# Altium project Bass Guitar Amp.PrjPcb (part 1 of 4)
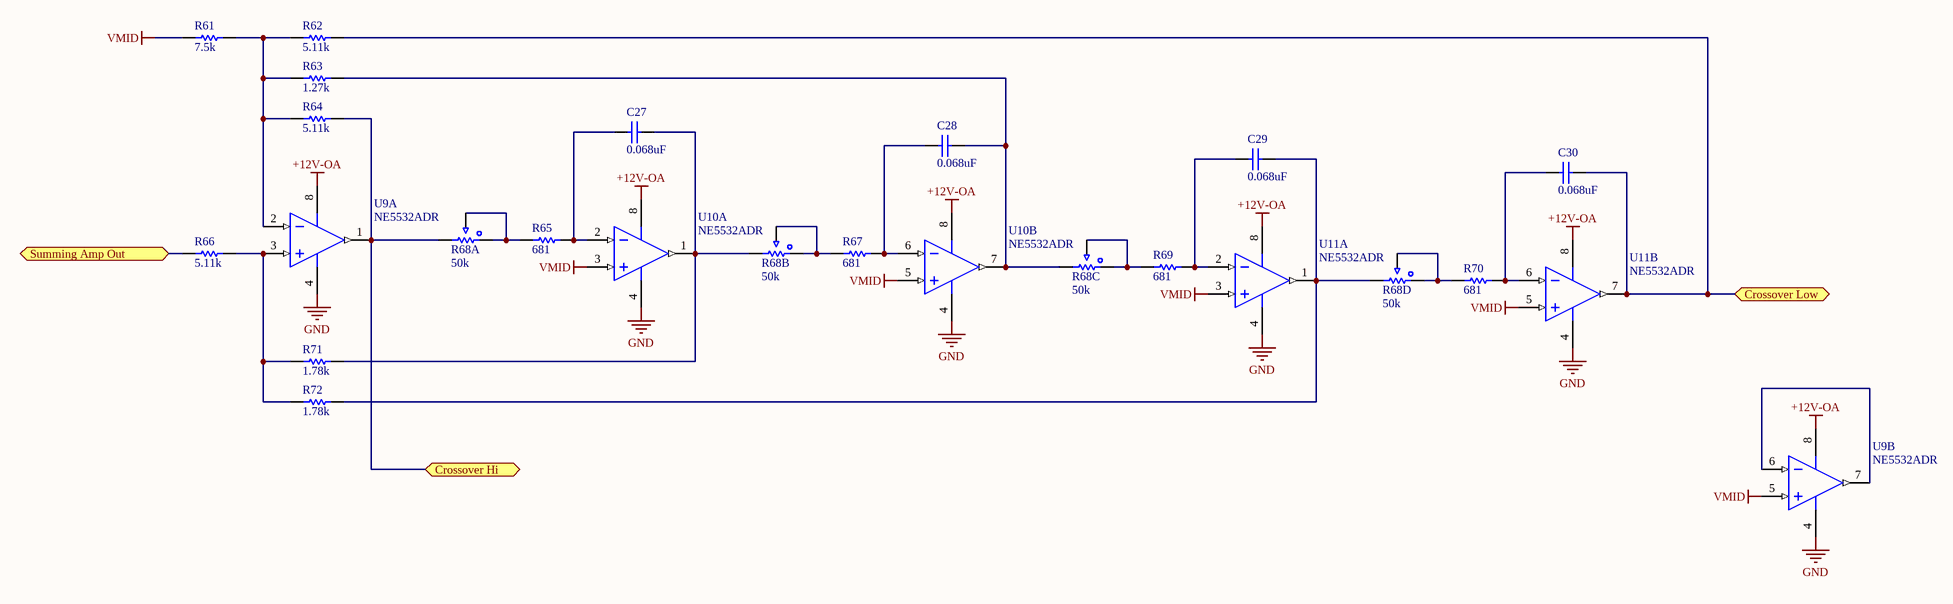
[diagram p0: Crossover.SchDoc]
5 sheets, 270 parts. Net scope: flat (ports and power ports of the same name join across sheets).
Sheets:
  Crossover.SchDoc
  IO Management.SchDoc
  Power Management.SchDoc
  Power Stage.SchDoc
  SideGig.SchDoc

## Sheet Crossover.SchDoc
size C

### Parts
C27  0.068uF  [RESC3216X70X50NL05T20]
C28  0.068uF  [RESC3216X70X50NL05T20]
C29  0.068uF  [RESC3216X70X50NL05T20]
C30  0.068uF  [RESC3216X70X50NL05T20]
R61  7.5k  [RESC1609X55X28LL05T18]
R62  5.11k  [PCB-dm6f2vlmfnf97yy2nsh5-1]
R63  1.27k  [RESC1609X55X28LL05T18]
R64  5.11k  [PCB-dm6f2vlmfnf97yy2nsh5-1]
R65  681  [RESC1609X55X28LL05T18]
R66  5.11k  [PCB-dm6f2vlmfnf97yy2nsh5-1]
R67  681  [RESC1609X55X28LL05T18]
R68  50k  [PCB-3c7eria7znpasna51pjn-1]  (parts A,B,C,D of 4)
R69  681  [RESC1609X55X28LL05T18]
R70  681  [RESC1609X55X28LL05T18]
R71  1.78k  [RESC1609X55X28LL05T18]
R72  1.78k  [RESC1609X55X28LL05T18]
U9  NE5532ADR  [TI-D8_L]  (parts A,B of 2)
U10  NE5532ADR  [TI-D8_L]  (parts A,B of 2)
U11  NE5532ADR  [TI-D8_L]  (parts A,B of 2)

### Ports
Crossover Hi, Crossover Low, Summing Amp Out

### Nets
+12V-OA: U9.8(VCC+) U10.8(VCC+) U11.8(VCC+)
GND: U9.4(VCC-) U10.4(VCC-) U11.4(VCC-)
VMID: R61.1 U9.5(IN2+) U10.3(IN1+) U10.5(IN2+) U11.3(IN1+) U11.5(IN2+)
NetC27_1: C27.1 R65.2 U10.2(IN1-)
NetC27_2: C27.2 R68.R2_3 R71.2 U10.1(OUT1)
NetC28_1: C28.1 R67.2 U10.6(IN2-)
NetC28_2: C28.2 R63.2 R68.R3_3 U10.7(OUT2)
NetC29_1: C29.1 R69.2 U11.2(IN1-)
NetC29_2: C29.2 R68.R4_3 R72.2 U11.1(OUT1)
NetC30_1: C30.1 R70.2 U11.6(IN2-)
NetC30_2: C30.2 R62.2 U11.7(OUT2) ; port Crossover Low
NetJ3_3: R64.2 R68.R1_3 U9.1(OUT1) ; port Crossover Hi
NetJ3_4: R66.1 ; port Summing Amp Out
NetR61_2: R61.2 R62.1 R63.1 R64.1 U9.2(IN1-)
NetR65_1: R65.1 R68.R1_1 R68.R1_2
NetR66_2: R66.2 R71.1 R72.1 U9.3(IN1+)
NetR67_1: R67.1 R68.R2_1 R68.R2_2
NetR68_R3_1: R68.R3_1 R68.R3_2 R69.1
NetR68_R4_1: R68.R4_1 R68.R4_2 R70.1
NetU9_6: U9.6(IN2-) U9.7(OUT2)

### Library data of the parts
C27-C30 = CMP-f94231c42cf32685-1: C Series 1206 50 V 0.068 uF ±5% Tolerance C0G SMT Multilayer Ceramic Capacitor; Voltage Rating (DC): 50.0 V; RoHS: Compliant
R61 = CMP-2e48e5fbd8dbf18f-1: Res Thin Film 0603 7.5K Ohm 0.1% 0.1W(1/10W) ±25ppm/C SMD Automotive T/R; Manufacturer: Vishay; Manufacturer Part Number: MCT0603MD7501BP100; Octopart URL: http://octopart.com/mct0603md7501bp100-vishay-45732853; Case/Package: 0603; Packaging: Reel; RoHS: Compliant; OctopartID: 2e48e5fbd8dbf18f
R62 R64 R66 = CMP-3220f9ecb51bede7-1: Res Thin Film 0603 5.11K Ohm 0.1% 1/10W ±25ppm/°C Molded SMD SMD Paper T/R; Manufacturer Part Number: MCT06030D5111BP100; Power Rating: 100 mW; Octopart URL: http://octopart.com/mct06030d5111bp100-vishay-46572125; Packaging: Tape & Reel (TR); RoHS: Compliant
R63 = CMP-169edd529233c959-1: Res Thin Film 0603 1.27K Ohm 0.1% 1/10W ±25ppm/°C Molded SMD SMD Paper T/R; Manufacturer Part Number: MCT06030D1271BP100; Voltage Rating (DC): 50.0 V; Resistance: 1.27 kΩ; Temperature Coefficient: 25.0 ppm/°C; Power Rating: 100 mW; Lead-Free Status: Lead Free; Size-Height: 450 µm; Case/Package: 0603; Octopart URL: http://octopart.com/mct06030d1271bp100-vishay-46571979; Mounting Style: Surface Mount; RoHS: Compliant; OctopartID: 169edd529233c959; Size-Width: 850 µm; Resistance Tolerance: ±0.1%
R65 R67 R69 R70 = CMP-437288bec46a9cb5-1: Res Thin Film 0603 681 Ohm 0.1% 1/10W ±25ppm/°C Molded SMD SMD Paper T/R; OctopartID: 437288bec46a9cb5; Size-Height: 450 µm; Mounting Style: Surface Mount
R68 = CMP-1b48d3c31cb2c48f-2: PTD90 Series 9mm Multi Ganged Potentiometer 50K Ohm 20% 0.05 W 1(Elec)/1(Mech)Turn Panel Mount/Thru-Hole Tray; Octopart URL: http://octopart.com/ptd904-2015k-b503-bourns-25240220; OctopartID: 1b48d3c31cb2c48f; Resistance: 50k
R71 R72 = CMP-0169caa585e3deae-1: Res Thin Film 0603 1.78K Ohm 0.1% 1/10W ±25ppm/°C Molded SMD Paper T/R; Power Rating: 100 mW
U9-U11 = CMP-13597030-2: Dual Low-Noise Operational Amplifier, 10 to 30 V, 0 to 70 degC, 8-pin SOIC (D8), Green (RoHS & no Sb/Br); Bandwidth: 10000000.0 Hz; Lead-Free Status: Lead Free; Number of Channels: 2; Slew Rate: 9.0 V/μs; Supply Voltage (DC): 30.0 V; Gain Bandwidth Product: 10000000.0 Hz; Lifecycle Status: Active; Mounting Style: Surface Mount; Number of Circuits: 2; Number of Pins: 8; Octopart Url: https://octopart.com/ne5532adr-texas+instruments-409175; OctopartID: 270fee033c3ef8c8; Packaging: Tape & Reel (TR); REACH SVHC Compliance: No SVHC; RoHS: Compliant

## Sheet IO Management.SchDoc
size C
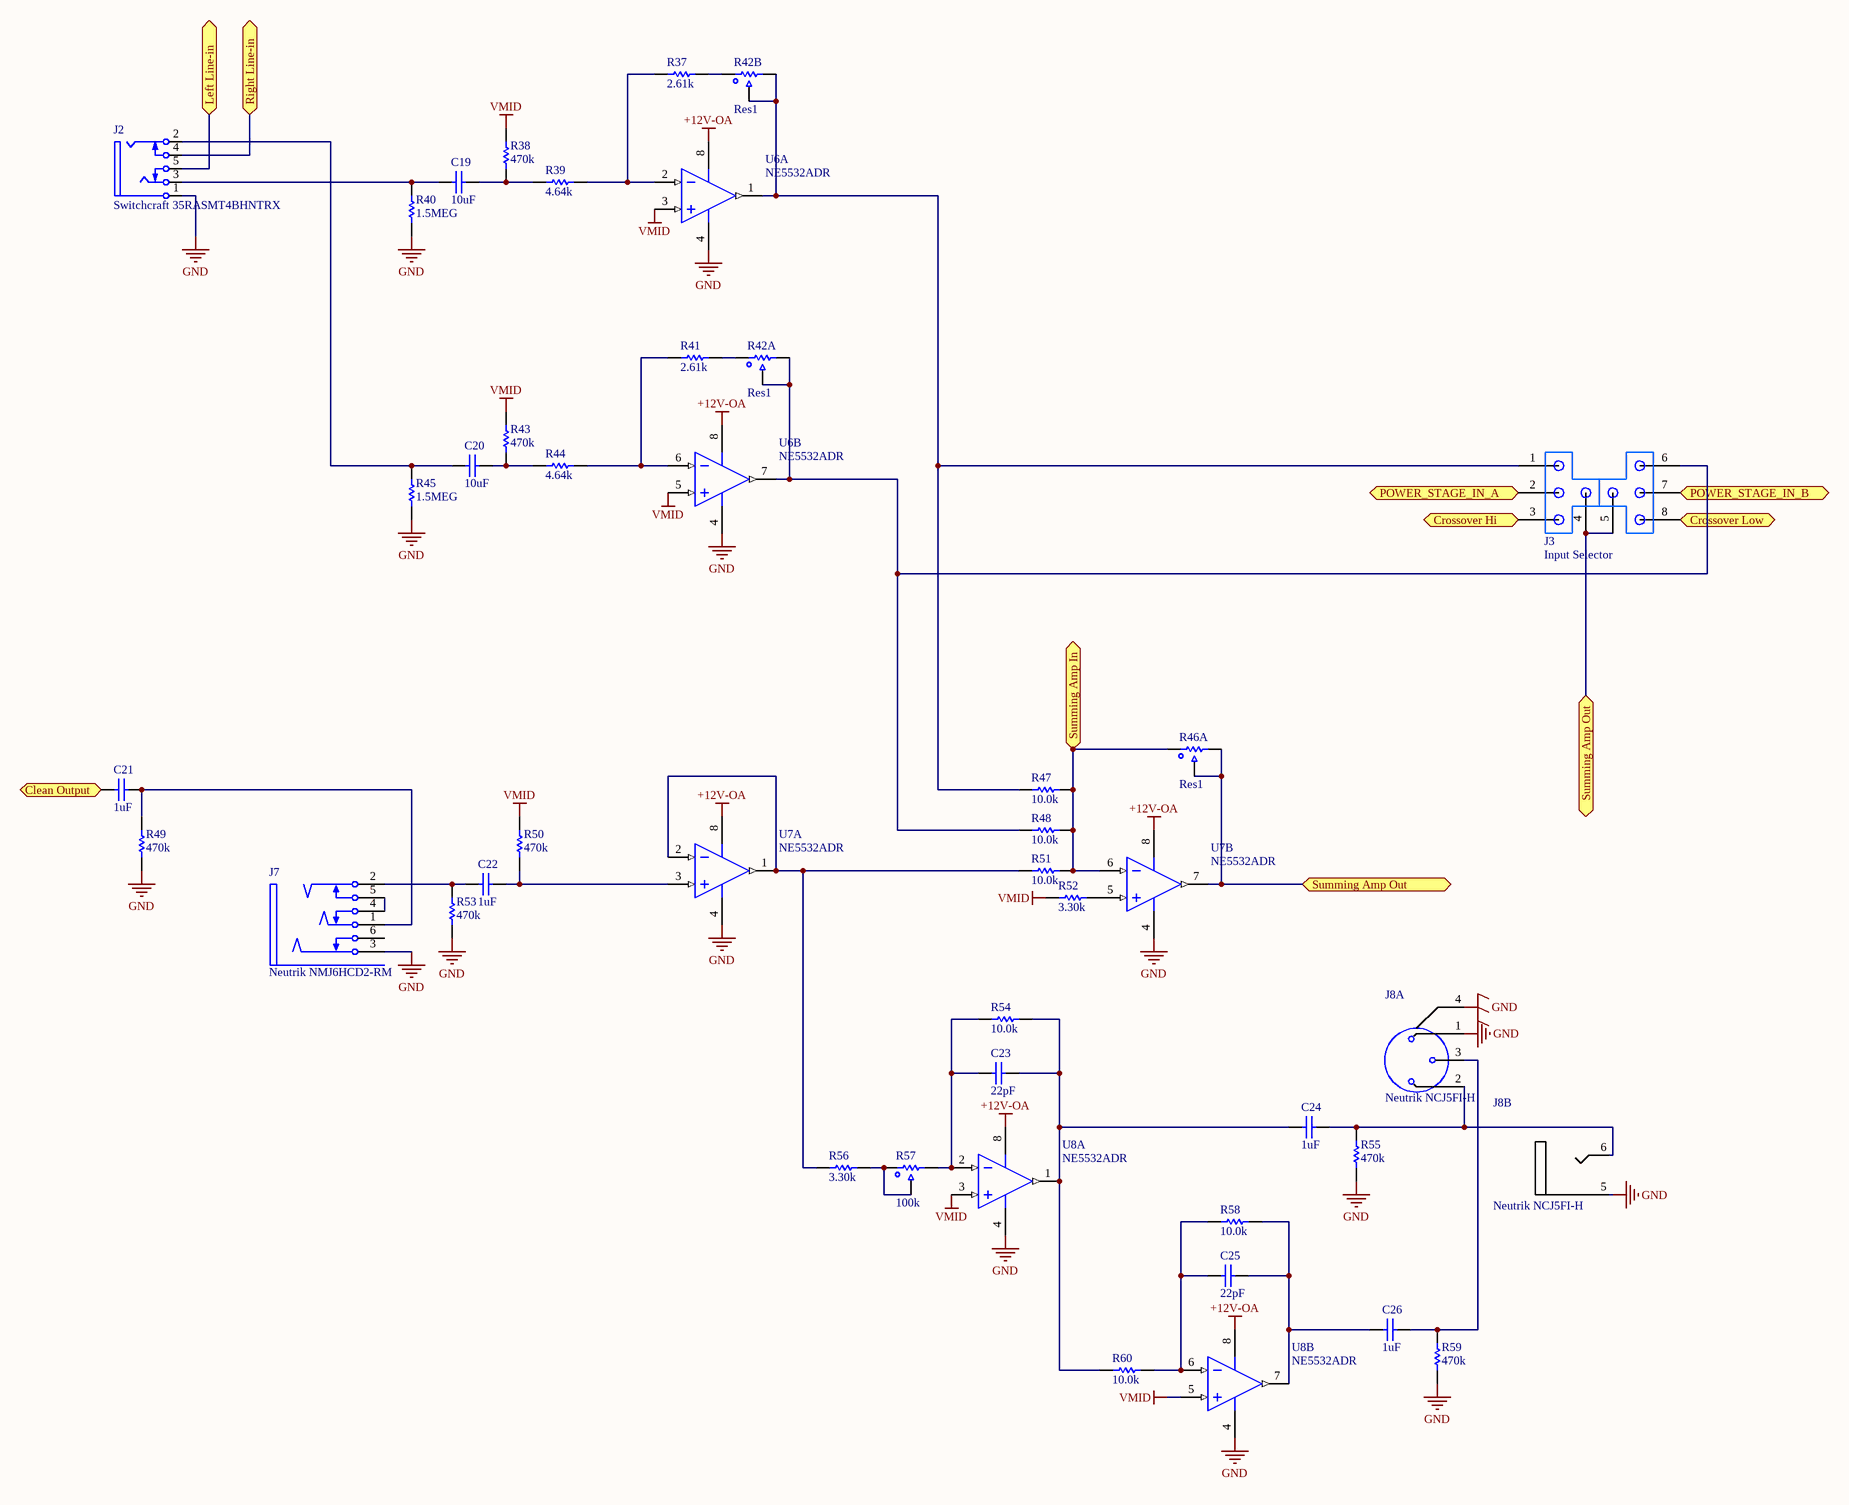
[diagram p1: IO Management.SchDoc]

### Parts
C19  10uF  [PCB-5c5sxu4lzqbcrp2k6kwf-1]
C20  10uF  [PCB-5c5sxu4lzqbcrp2k6kwf-1]
C21  1uF  [PCB-2wbb7ys4jm9z9dflo2i2-1]
C22  1uF  [PCB-2wbb7ys4jm9z9dflo2i2-1]
C23  22pF  [PCB-o7p1koxmr9wqz41gh50t-1]
C24  1uF  [PCB-2wbb7ys4jm9z9dflo2i2-1]
C25  22pF  [PCB-o7p1koxmr9wqz41gh50t-1]
C26  1uF  [PCB-2wbb7ys4jm9z9dflo2i2-1]
J2  Switchcraft 35RASMT4BHNTRX  [SWIT-35RASMT4BHNTRX_V]
J3  Input Selector  [PCB-r6lzv2511lj5epnn9hpr-1]
J7  Neutrik NMJ6HCD2-RM  [PCB-3345220-1]
J8  Neutrik NCJ5FI-H  [PCB-kqs2tegzu26oi3jl7i0a-1]  (parts A,B of 2)
R37  2.61k  [PCB-2fy4x9bysi6rpexrr8fu-1]
R38  470k  [RESC1609X55X28LL05T18]
R39  4.64k  [RESC1609X55X28LL05T18]
R40  1.5MEG  [RESC1608X55X30LL15T15]
R41  2.61k  [PCB-2fy4x9bysi6rpexrr8fu-1]
R42  Res1  [PCB-3c7eria7znpasna51pjn-1]  (parts A,B of 2)
R43  470k  [RESC1609X55X28LL05T18]
R44  4.64k  [RESC1609X55X28LL05T18]
R45  1.5MEG  [RESC1608X55X30LL15T15]
R46  Res1  [PCB-3c7eria7znpasna51pjn-1]  (part A of 2)
R47  10.0k  [RESC1609X55X28LL05T18]
R48  10.0k  [RESC1609X55X28LL05T18]
R49  470k  [RESC1609X55X28LL05T18]
R50  470k  [RESC1609X55X28LL05T18]
R51  10.0k  [RESC1609X55X28LL05T18]
R52  3.30k  [RESC1609X55X28LL05T18]
R53  470k  [RESC1609X55X28LL05T18]
R54  10.0k  [RESC1609X55X28LL05T18]
R55  470k  [RESC1609X55X28LL05T18]
R56  3.30k  [RESC1609X55X28LL05T18]
R57  100k  [PCB-3c7eria7znpasna51pjn-1]
R58  10.0k  [RESC1609X55X28LL05T18]
R59  470k  [RESC1609X55X28LL05T18]
R60  10.0k  [RESC1609X55X28LL05T18]
U6  NE5532ADR  [TI-D8_L]  (parts A,B of 2)
U7  NE5532ADR  [TI-D8_L]  (parts A,B of 2)
U8  NE5532ADR  [TI-D8_L]  (parts A,B of 2)

### Ports
Clean Output, Crossover Hi, Crossover Low, Left Line-in, POWER_STAGE_IN_A, POWER_STAGE_IN_B, Right Line-in, Summing Amp In, Summing Amp Out

### Nets
+12V-OA: U6.8(VCC+) U7.8(VCC+) U8.8(VCC+)
GND: J2.1 J7.3 J8.1 J8.4(G) J8.5(S) R40.1 R45.1 R49.1 R53.1 R55.1 R59.1 U6.4(VCC-) U7.4(VCC-) U8.4(VCC-)
VMID: R38.2 R43.2 R50.2 R52.1 U6.3(IN1+) U6.5(IN2+) U8.3(IN1+) U8.5(IN2+)
NetC19_1: C19.1 J2.3 R40.2
NetC19_2: C19.2 R38.1 R39.1
NetC20_1: C20.1 J2.2 R45.2
NetC20_2: C20.2 R43.1 R44.1
NetC21_1: C21.1 ; port Clean Output
NetC21_2: C21.2 J7.1 R49.2
NetC22_1: C22.1 J7.2 R53.2
NetC22_2: C22.2 R50.1 U7.3(IN1+)
NetC23_1: C23.1 R54.1 R57.3 U8.2(IN1-)
NetC23_2: C23.2 C24.1 R54.2 R60.1 U8.1(OUT1)
NetC24_2: C24.2 J8.2 J8.6(T) R55.2
NetC25_1: C25.1 R58.1 R60.2 U8.6(IN2-)
NetC25_2: C25.2 C26.1 R58.2 U8.7(OUT2)
NetC26_2: C26.2 J8.3 R59.2
NetC30_2: J3.8 ; port Crossover Low
NetJ2_4: J2.4 ; port Right Line-in
NetJ2_5: J2.5 ; port Left Line-in
NetJ3_1: J3.1 R42.R2_2 R42.R2_3 R47.1 U6.1(OUT1)
NetJ3_2: J3.2 ; port POWER_STAGE_IN_A
NetJ3_3: J3.3 ; port Crossover Hi
NetJ3_4: J3.4 J3.5 R46.R1_2 R46.R1_3 U7.7(OUT2) ; port Summing Amp Out
NetJ3_6: J3.6 R42.R1_2 R42.R1_3 R48.1 U6.7(OUT2)
NetJ3_7: J3.7 ; port POWER_STAGE_IN_B
NetJ7_4: J7.4 J7.5
NetJ15_4: R46.R1_1 R47.2 R48.2 R51.2 U7.6(IN2-) ; port Summing Amp In
NetR37_1: R37.1 R39.2 U6.2(IN1-)
NetR37_2: R37.2 R42.R2_1
NetR41_1: R41.1 R44.2 U6.6(IN2-)
NetR41_2: R41.2 R42.R1_1
NetR51_1: R51.1 R56.1 U7.1(OUT1) U7.2(IN1-)
NetR52_2: R52.2 U7.5(IN2+)
NetR56_2: R56.2 R57.1 R57.2

Not connected (* = marked no-connect by the designer): J7 6

### Library data of the parts
C19 C20 = CMP-f13b3967d5202efc-1: Cap Film 10uF 63V PET 5% (26.5 X 8.5 X 17mm) Radial Wound 22.5mm 105C Automotive Bulk; Manufacturer Part Number: 60DN51005030J; Manufacturer: Kemet; RoHS: Compliant; Capacitance: 10uF; OctopartID: f13b3967d5202efc
C21 C22 C24 C26 = CMP-85fe4cf7e9a75a39-2: B32529 Series 63 V 1 uF Radial LS=5 mm Stacked Metallized PET Film Capacitor; Manufacturer Part Number: B32529C105J289; Manufacturer: TDK; Capacitance: 1uF
C23 C25 = CMP-5839914dedd787fe-1: CL10 Series 22 pF 50V ±5 % Tolerance C0G SMT Multilayer Ceramic Capacitor; Manufacturer: Samsung; Manufacturer Part Number: CL10C220JB8NNNC; Dielectric Characteristic: C0G/NP0; Octopart URL: http://octopart.com/cl10c220jb8nnnc-samsung-8294536; Mounting Style: Surface Mount
J2 = CMP-329442-8: Female 3.5 mm Phone Jack, 5 Position, Height 5 mm, RoHS, Tape and Reel; Lead-Free Status: Lead Free; RoHS: Compliant; PackageDescription: Female 3.5 mm Phone Jack, 5 Position, Height 5 mm; OctopartID: 05ecccef17f4da2b; Seller Landing  Url: https://octopart-clicks.com/click/track?country=US&ak=8157f166&sig=00fbda3&sid=459&ppid=604030&vpid=40873333&ct=offers; Octopart Url: http://octopart.com/35rasmt4bhntrx-switchcraft-604030; PackageReference: 35RASMT4BHNTRX; Manufacturer Part Number: 35RASMT4BHNTRX; DatasheetVersion: Rev. C, 07/2014
J3 = CMP-fydh8mqcn19uwpn0klog-2: 3 way stereo H-shaped pin header jumper 2.54mm
J7 = CMP-3345220-6: Phone Connectors 1/4" STERO JCK SWTCH FULL TRD NSE PC HORZ; OctopartID: de6b171403b801ac; Manufacturer: Neutrik; Manufacturer Part Number: NMJ6HCD2-RM; Octopart Url: https://octopart.com/nmj6hcd2-rm-neutrik-7731381
J8 = CMP-d6ad1fac6a3f096a-1: Neutrik NCJ5FI-H Combo 3-Pin XLRF / 1/4 Inch Mono Horizontal PCB Mount; Gender: Female; Voltage Rating (DC): 50.0 V; Number of Positions: 5; Octopart URL: http://octopart.com/ncj5fi-h-neutrik-760308; OctopartID: d6ad1fac6a3f096a; Contact Plating: Gold; Mounting Style: Solder, PCB; RoHS: Compliant; Manufacturer Part Number: NCJ5FI-H; Manufacturer: Neutrik
R37 R41 = CMP-9c6957e4a20743ae-1: Res Thin Film 0603 2.61K Ohm 0.1% 1/10W ±25ppm/°C Molded SMD Paper T/R; Manufacturer: Vishay; Manufacturer Part Number: MCT06030D2611BP100; Resistance: 2.61 kΩ; Power Rating: 100 mW; Size-Length: 1.55 mm; Resistance Tolerance: ±0.1%; Packaging: Tape & Reel (TR)
R38 R43 R49 R50 R53 R55 R59 = CMP-f7e03fd772d42827-1: Res Thin Film 0603 470K Ohm 0.1% 1/10W ±25ppm/°C Molded SMD SMD Paper T/R; Manufacturer Part Number: MCT06030D4703BP100; Lead-Free Status: Lead Free
R39 R44 = CMP-ae07668bb89171c0-1: Res Thin Film 0603 4.64K Ohm 0.1% 1/10W ±25ppm/°C Molded SMD SMD Paper T/R; Manufacturer Part Number: MCT06030D4641BP100; Power Rating: 100 mW; Lead-Free Status: Lead Free; Size-Width: 850 µm; Size-Length: 1.55 mm; Packaging: Tape & Reel (TR); Case/Package: 0603; Mounting Style: Surface Mount; Octopart URL: http://octopart.com/mct06030d4641bp100-vishay+semiconductor-25572336; Resistance Tolerance: ±0.1%; OctopartID: ae07668bb89171c0; RoHS: Compliant
R40 R45 = CMP-3681775-2: Thick Film Resistors - SMD 0603 1.5Mohms 1% Tol; Manufacturer Part Number: ERJ-3EKF1504V; Manufacturer: Panasonic; Lead-Free Status: Lead Free; Power Rating: 0.1 W; Resistance: 1500000.0 Ω; Voltage Rating (DC): 75.0 V; Case/Package: 0603; Lifecycle Status: Not Listed by Manufacturer; Mounting Style: Surface Mount; Octopart Url: https://octopart.com/erj-3ekf1504v-panasonic-55421490; OctopartID: f919335e764d26de; Packaging: Cut Tape (CT); Resistance Tolerance: ±1%; RoHS: Compliant; Size-Height: 0.00045 m; Size-Length: 0.0016 m; Size-Width: 0.0008 m
R42 R46 = CMP-f1923a8ba4e42e55-1: Panel Control - 9mm-St-Carbon; Packaging: Tray
R47 R48 R51 R54 R58 R60 = CMP-893e42b9f3a056f9-1: Precision Thin Film Smnt Resistor 0603 Case 10kOhm +/-0.1% 0.1W +/-25ppm/degC; Manufacturer: Vishay; Manufacturer Part Number: MCT06030D1002BP100; Lead-Free Status: Lead Free; Resistance Tolerance: ±0.1%; Voltage Rating (DC): 50.0 V; Resistance: 10.0 kΩ; Power Rating: 100 mW; Packaging: Tape & Reel (TR); RoHS: Compliant; Mounting Style: Surface Mount; Size-Length: 1.55 mm; Size-Width: 850 µm; Octopart URL: http://octopart.com/mct06030d1002bp100-vishay-42819576; Case/Package: 0603; Size-Height: 450 µm
R52 R56 = CMP-182ad3b0fdf8c7ed-1: Precision Thin Film Smnt Resistor 0603 Case 3.3kOhm +/-0.1% 0.1W +/-25ppm/C; Manufacturer: Vishay; Manufacturer Part Number: MCT06030D3301BP100; Resistance: 3.30 kΩ; Resistance Tolerance: ±0.1%; Octopart URL: http://octopart.com/mct06030d3301bp100-vishay-43040948; RoHS: Compliant; Size-Height: 450 µm; OctopartID: 182ad3b0fdf8c7ed; Case/Package: 0603; Mounting Style: Surface Mount; Size-Width: 850 µm
R57 = CMP-015dc8c8d918de9a-1: Pot 100k Ohm 1/20w Carbon Linear; Manufacturer Part Number: PTD901-2015F-B104; Mounting Style: PCB, Board, Panel; OctopartID: 015dc8c8d918de9a; Packaging: Tray
U6-U8 = CMP-13597030-2: as U9 on sheet Crossover; Gain Bandwidth Product: 10000000.0 Hz; Lifecycle Status: Active; Mounting Style: Surface Mount; Number of Circuits: 2; Number of Pins: 8; Octopart Url: https://octopart.com/ne5532adr-texas+instruments-409175; OctopartID: 270fee033c3ef8c8; Packaging: Tape & Reel (TR); REACH SVHC Compliance: No SVHC; RoHS: Compliant

## Sheet Power Management.SchDoc
size C
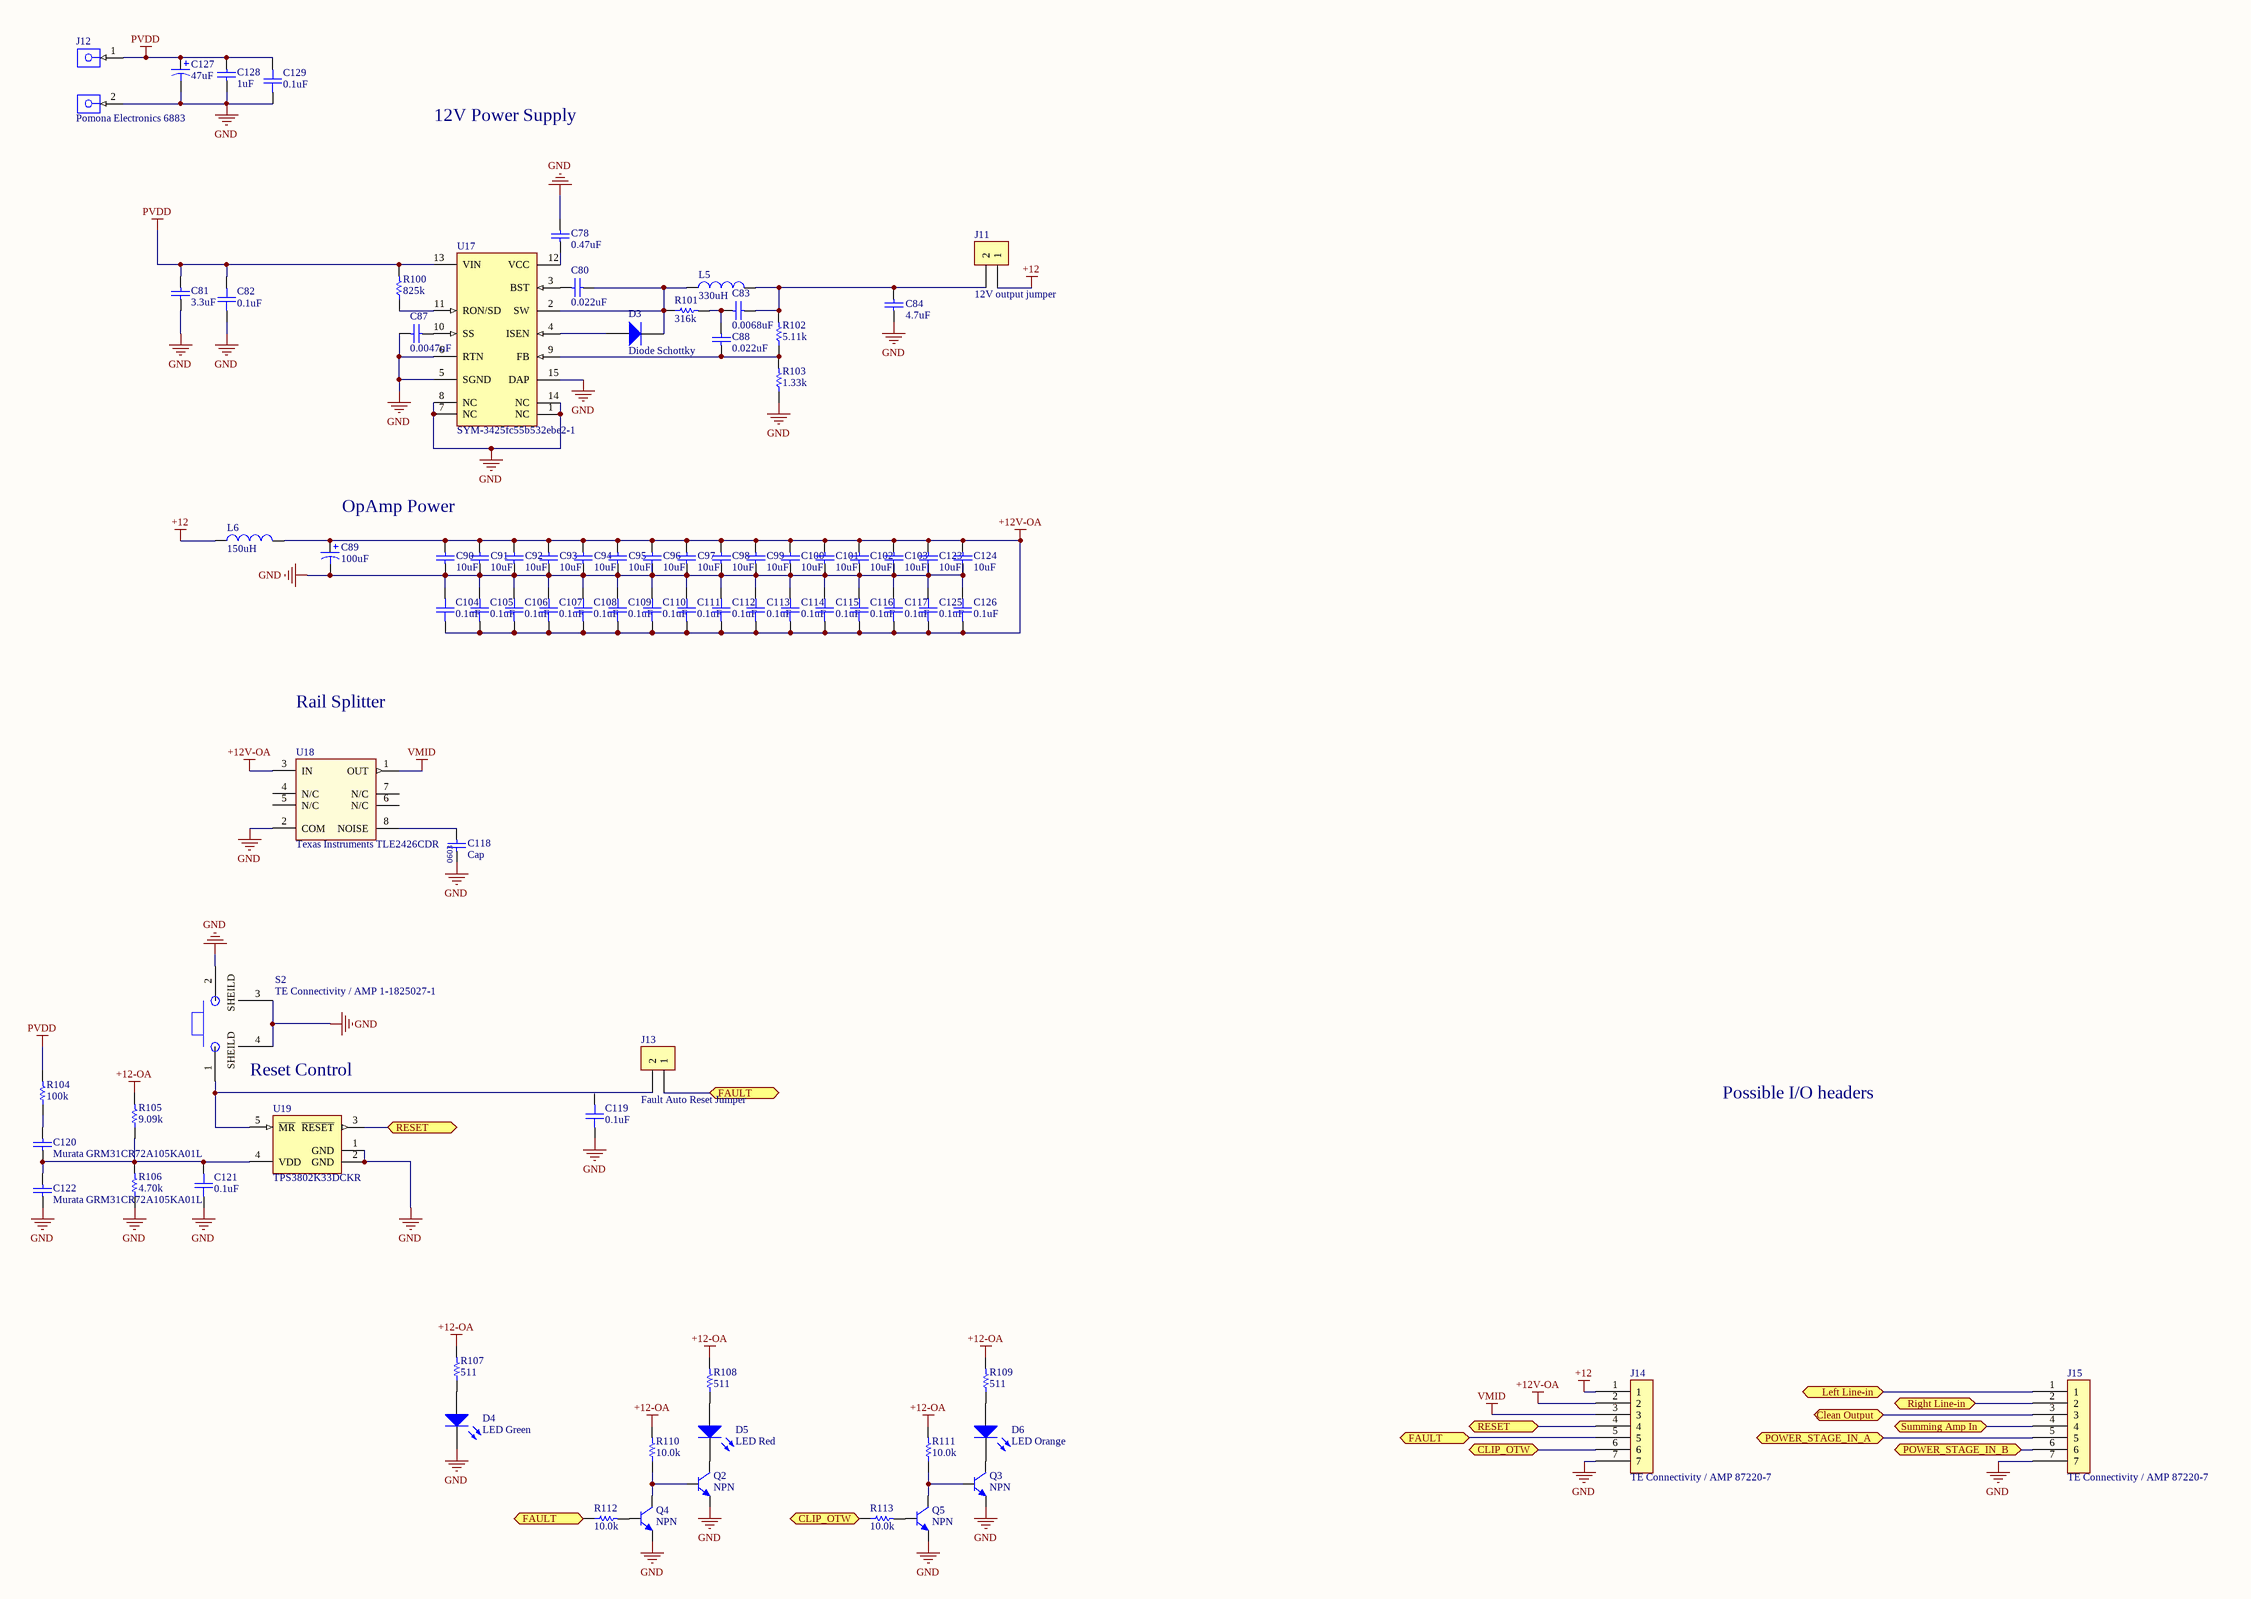
[diagram p2: Power Management.SchDoc]

### Parts
C78  0.47uF  [PCB-i0dme2so6deleduh8uuv-1]
C80  0.022uF  [CAPC1608X87X35NL15T15]
C81  3.3uF  [PCB-chn8p1js4k1ngrwxbp4y-1]
C82  0.1uF  [PCB-jzhgzaa3ohr19x5vw660-1]
C83  0.0068uF  [CAPC1608X06N]
C84  4.7uF  [CAPC2013X94X50LL20T25]
C87  0.0047uF  [CAPC2012X08M]
C88  0.022uF  [CAPC1608X87X35NL15T15]
C89  100uF  [PCB-in8pxjyymzgw21cvj8kw-1]
C90  10uF  [CAPC3216X94X50NL20T25]
C91  10uF  [CAPC3216X94X50NL20T25]
C92  10uF  [CAPC3216X94X50NL20T25]
C93  10uF  [CAPC3216X94X50NL20T25]
C94  10uF  [CAPC3216X94X50NL20T25]
C95  10uF  [CAPC3216X94X50NL20T25]
C96  10uF  [CAPC3216X94X50NL20T25]
C97  10uF  [CAPC3216X94X50NL20T25]
C98  10uF  [CAPC3216X94X50NL20T25]
C99  10uF  [CAPC3216X94X50NL20T25]
C100  10uF  [CAPC3216X94X50NL20T25]
C101  10uF  [CAPC3216X94X50NL20T25]
C102  10uF  [CAPC3216X94X50NL20T25]
C103  10uF  [CAPC3216X94X50NL20T25]
C104  0.1uF  [PCB-jzhgzaa3ohr19x5vw660-1]
C105  0.1uF  [PCB-jzhgzaa3ohr19x5vw660-1]
C106  0.1uF  [PCB-jzhgzaa3ohr19x5vw660-1]
C107  0.1uF  [PCB-jzhgzaa3ohr19x5vw660-1]
C108  0.1uF  [PCB-jzhgzaa3ohr19x5vw660-1]
C109  0.1uF  [PCB-jzhgzaa3ohr19x5vw660-1]
C110  0.1uF  [PCB-jzhgzaa3ohr19x5vw660-1]
C111  0.1uF  [PCB-jzhgzaa3ohr19x5vw660-1]
C112  0.1uF  [PCB-jzhgzaa3ohr19x5vw660-1]
C113  0.1uF  [PCB-jzhgzaa3ohr19x5vw660-1]
C114  0.1uF  [PCB-jzhgzaa3ohr19x5vw660-1]
C115  0.1uF  [PCB-jzhgzaa3ohr19x5vw660-1]
C116  0.1uF  [PCB-jzhgzaa3ohr19x5vw660-1]
C117  0.1uF  [PCB-jzhgzaa3ohr19x5vw660-1]
C118  Cap  [CAPC1608X07N]
C119  0.1uF  [PCB-jzhgzaa3ohr19x5vw660-1]
C120  Murata GRM31CR72A105KA01L  [CAPC3216X180X55NL20T25]
C121  0.1uF  [PCB-jzhgzaa3ohr19x5vw660-1]
C122  Murata GRM31CR72A105KA01L  [CAPC3216X180X55NL20T25]
C123  10uF  [CAPC3216X94X50NL20T25]
C124  10uF  [CAPC3216X94X50NL20T25]
C125  0.1uF  [PCB-jzhgzaa3ohr19x5vw660-1]
C126  0.1uF  [PCB-jzhgzaa3ohr19x5vw660-1]
C127  47uF  [PCBComponent_1]
C128  1uF  [CAPC3216X180X55NL20T25]
C129  0.1uF  [PCB-jzhgzaa3ohr19x5vw660-1]
D3  Diode Schottky  [PCB-iur9xjol2nuz7see6iaw-1]
D4  LED Green  [PCB - LS A67K]
D5  LED Red  [PCB - LS A67K]
D6  LED Orange  [PCB - LS A67K]
J11  12V output jumper  [PCB-atpiihg40e8c2nmcy2an-1]
J12  Pomona Electronics 6883  [PCB-19368571-1]
J13  Fault Auto Reset Jumper  [PCB-atpiihg40e8c2nmcy2an-1]
J14  TE Connectivity / AMP 87220-7  [PCB-2nimx3srux7q5lcqcrab-1]
J15  TE Connectivity / AMP 87220-7  [PCB-2nimx3srux7q5lcqcrab-1]
L5  330uH  [Coilcraft MSS1210]
L6  150uH  [PCB-lfrzme2idivti55vz3sm-1]
Q2  NPN  [PCB-zwf9crilb66v8jey4z70-1]
Q3  NPN  [PCB-zwf9crilb66v8jey4z70-1]
Q4  NPN  [PCB-zwf9crilb66v8jey4z70-1]
Q5  NPN  [PCB-zwf9crilb66v8jey4z70-1]
R100  825k  [RESC1609X55X28LL05T18]
R101  316k  [RESC1609X55X28LL05T18]
R102  5.11k  [PCB-dm6f2vlmfnf97yy2nsh5-1]
R103  1.33k  [RESC1609X55X28LL05T18]
R104  100k  [RESC1609X55X28LL05T18]
R105  9.09k  [RESC1609X55X28LL05T18]
R106  4.70k  [RESC1609X55X28LL05T18]
R107  511  [RESC1609X55X28LL05T18]
R108  511  [RESC1609X55X28LL05T18]
R109  511  [RESC1609X55X28LL05T18]
R110  10.0k  [RESC1609X55X28LL05T18]
R111  10.0k  [RESC1609X55X28LL05T18]
R112  10.0k  [RESC1609X55X28LL05T18]
R113  10.0k  [RESC1609X55X28LL05T18]
S2  TE Connectivity / AMP 1-1825027-1  [PCB-z0tn1x4l8qb5b43a6q2n-1]
U17  SYM-3425fc55b532ebe2-1  [PCB-d66e4jgxn3exdfjea6yc-1]
U18  Texas Instruments TLE2426CDR  [INF-PG-DSO-8-3_M]
U19  TPS3802K33DCKR  [DCK5_N]

### Ports
Clean Output, CLIP_OTW, FAULT, Left Line-in, POWER_STAGE_IN_A, POWER_STAGE_IN_B, RESET, Right Line-in, Summing Amp In

### Nets
+12: J11.1 J14.1 L6.1
+12-OA: R105.2 R107.2 R108.2 R109.2 R110.2 R111.2
+12V-OA: C89.1 C90.2 C91.2 C92.2 C93.2 C94.2 C95.2 C96.2 C97.2 C98.2 C99.2 C100.2 C101.2 C102.2 C103.2 C104.1 C105.1 C106.1 C107.1 C108.1 C109.1 C110.1 C111.1 C112.1 C113.1 C114.1 C115.1 C116.1 C117.1 C123.2 C124.2 C125.1 C126.1 J14.2 L6.2 U18.3(IN)
GND: C78.2 C81.1 C82.1 C84.1 C87.1 C89.2 C90.1 C91.1 C92.1 C93.1 C94.1 C95.1 C96.1 C97.1 C98.1 C99.1 C100.1 C101.1 C102.1 C103.1 C104.2 C105.2 C106.2 C107.2 C108.2 C109.2 C110.2 C111.2 C112.2 C113.2 C114.2 C115.2 C116.2 C117.2 C118.1 C119.1 C121.1 C122.1 C123.1 C124.1 C125.2 C126.2 C127.2 C128.1 C129.1 D4.2(K) J12.2(-) J14.7 J15.7 Q2.2(E) Q3.2(E) Q4.2(E) Q5.2(E) R103.1 R106.1 U17.1(NC) U17.5(SGND) U17.6(RTN) U17.7(NC) U17.8(NC) U17.14(NC) U17.15(DAP) U18.2(COM) U19.1(GND) U19.2(GND)
PVDD: C81.2 C82.2 C127.1 C128.2 C129.2 J12.1(+) R100.2 R104.2 U17.13(VIN)
VMID: J14.3 U18.1(OUT)
NetC21_1: J15.3 ; port Clean Output
NetC78_1: C78.1 U17.12(VCC)
NetC80_1: C80.1 U17.3(BST)
NetC80_2: C80.2 D3.2(K) L5.1 R101.1 U17.2(SW)
NetC83_1: C83.1 C88.2 R101.2
NetC83_2: C83.2 C84.2 J11.2 L5.2 R102.2
NetC87_2: C87.2 U17.10(SS)
NetC88_1: C88.1 R102.1 R103.2 U17.9(FB)
NetC118_2: C118.2 U18.8(NOISE)
NetC120_1: C120.1 C121.2 C122.2 R105.1 R106.2 U19.4(VDD)
NetC120_2: C120.2 R104.1
NetD3_1: D3.1(A) U17.4(ISEN)
NetD4_1: D4.1(A) R107.1
NetD5_1: D5.1(K) Q2.3(C)
NetD5_2: D5.2(A) R108.1
NetD6_1: D6.1(A) R109.1
NetD6_2: D6.2(K) Q3.3(C)
NetJ2_4: J15.2 ; port Right Line-in
NetJ2_5: J15.1 ; port Left Line-in
NetJ3_2: J15.5 ; port POWER_STAGE_IN_A
NetJ3_7: J15.6 ; port POWER_STAGE_IN_B
NetJ13_1: J13.1 J14.5 R112.1 ; port FAULT
NetJ13_2: J13.2 U19.5(~{MR})
NetJ14_4: J14.4 U19.3(~{RESET}) ; port RESET
NetJ14_6: J14.6 R113.1 ; port CLIP_OTW
NetJ15_4: J15.4 ; port Summing Amp In
NetQ2_1: Q2.1(B) Q4.3(C) R110.1
NetQ3_1: Q3.1(B) Q5.3(C) R111.1
NetQ4_1: Q4.1(B) R112.2
NetQ5_1: Q5.1(B) R113.2
NetR100_1: R100.1 U17.11(RON/SD)

Not connected (* = marked no-connect by the designer): C119 2; S2 1 2 3 4; U18 4(N/C) 5(N/C) 6(N/C) 7(N/C)

### Notes on the sheet
- 12V Power Supply
- OpAmp Power
- Rail Splitter
- (near S2) Reset Control
- Possible I/O headers
- (in symbol CMP-4d86860896969241-7) SHEILD
- (in symbol CMP-463c8d25af8a99fb-1) 0603

### Library data of the parts
C78 = CMP-fe3b3644688f21fc-1: 1206 0.47 uF 100 V ±10% Tolerance X7R Multilayer Ceramic Chip Capacitor; Manufacturer Part Number: CC1206KKX7R0BB474; OctopartID: fe3b3644688f21fc; RoHS: Compliant; Octopart URL: https://octopart.com/cc1206kkx7r0bb474-yageo-24490962; Capacitance: 0.47 uF; Mounting Style: Surface Mount
C80 C88 = CMP-124409-3: CAP CER 0.022UF 100V X7R 0603; Manufacturer: Kemet; Manufacturer Part Number: C0603C223K1RACTU; Capacitance: 2.2e-08 F; Capacitance Tolerance: ±10%; Dielectric Material: Ceramic; Lead-Free Status: R; Voltage Rating (DC): 100.0 V; Case/Package: 0603; Dielectric Characteristic: X7R; Mounting Style: Surface Mount; Number of Pins: 2; Octopart Url: https://octopart.com/c0603c223k1ractu-kemet-150702; OctopartID: 7e94b79c175ca153; Packaging: Cut Tape (CT); REACH SVHC Compliance: No SVHC; RoHS: Compliant; Size-Height: 0.0008 m; Size-Length: 0.0016 m; Size-Width: 0.0008 m
C81 = CMP-d69b1be3b579095c-1: Cap Ceramic 3.3uF 100V X7R 10% Pad SMD 1812 125C Automotive T/R; Manufacturer Part Number: C1812C335K1RACAUTO
C82 C104-C117 C119 C121 C125 C126 C129 = CMP-120189-6: Capacitor 0.1 uF 100 Volt X7R 10% Surface Mount 0603 Paper Tape and Reel; Manufacturer Part Number: GRM188R72A104KA35D; Lead-Free Status: Lead Free; Voltage Rating (DC): 100V; Capacitance: 100n; Case/Package: 0603; Number of Pins: 2; Octopart URL: http://octopart.com/grm188r72a104ka35d-murata-196904; RoHS: Compliant; Dielectric Characteristic: X7R; Mounting Style: Surface Mount; OctopartID: f4783d71d0362bbf; Capacitance Tolerance: ±10%
C83 = CMP-2021ea3b622bffe6-1: Cap Ceramic 0.0068uF 100V C0G 5% Pad SMD 0603 125C T/R; RoHS: Compliant
C84 = CMP-120945-5: 0805 4.7 uF 25 V ±20% Tolerance X5R SMT Multilayer Ceramic Capacitor; Manufacturer: Murata; Manufacturer Part Number: GRM21BR61E475MA12L; Packaging: Cut Tape (CT); Size-Length: 2.00 mm; Capacitance Tolerance: ±20%; OctopartID: 948d5d4e8ecd4b4a
C87 = CMP-1cbed49aa786c379-1: Cap Ceramic 0.0047uF 100V X7R 10% SMD 0805 125°C Paper T/R